# EAGLE schematic XBEErec (EAGLE 6.6.0)
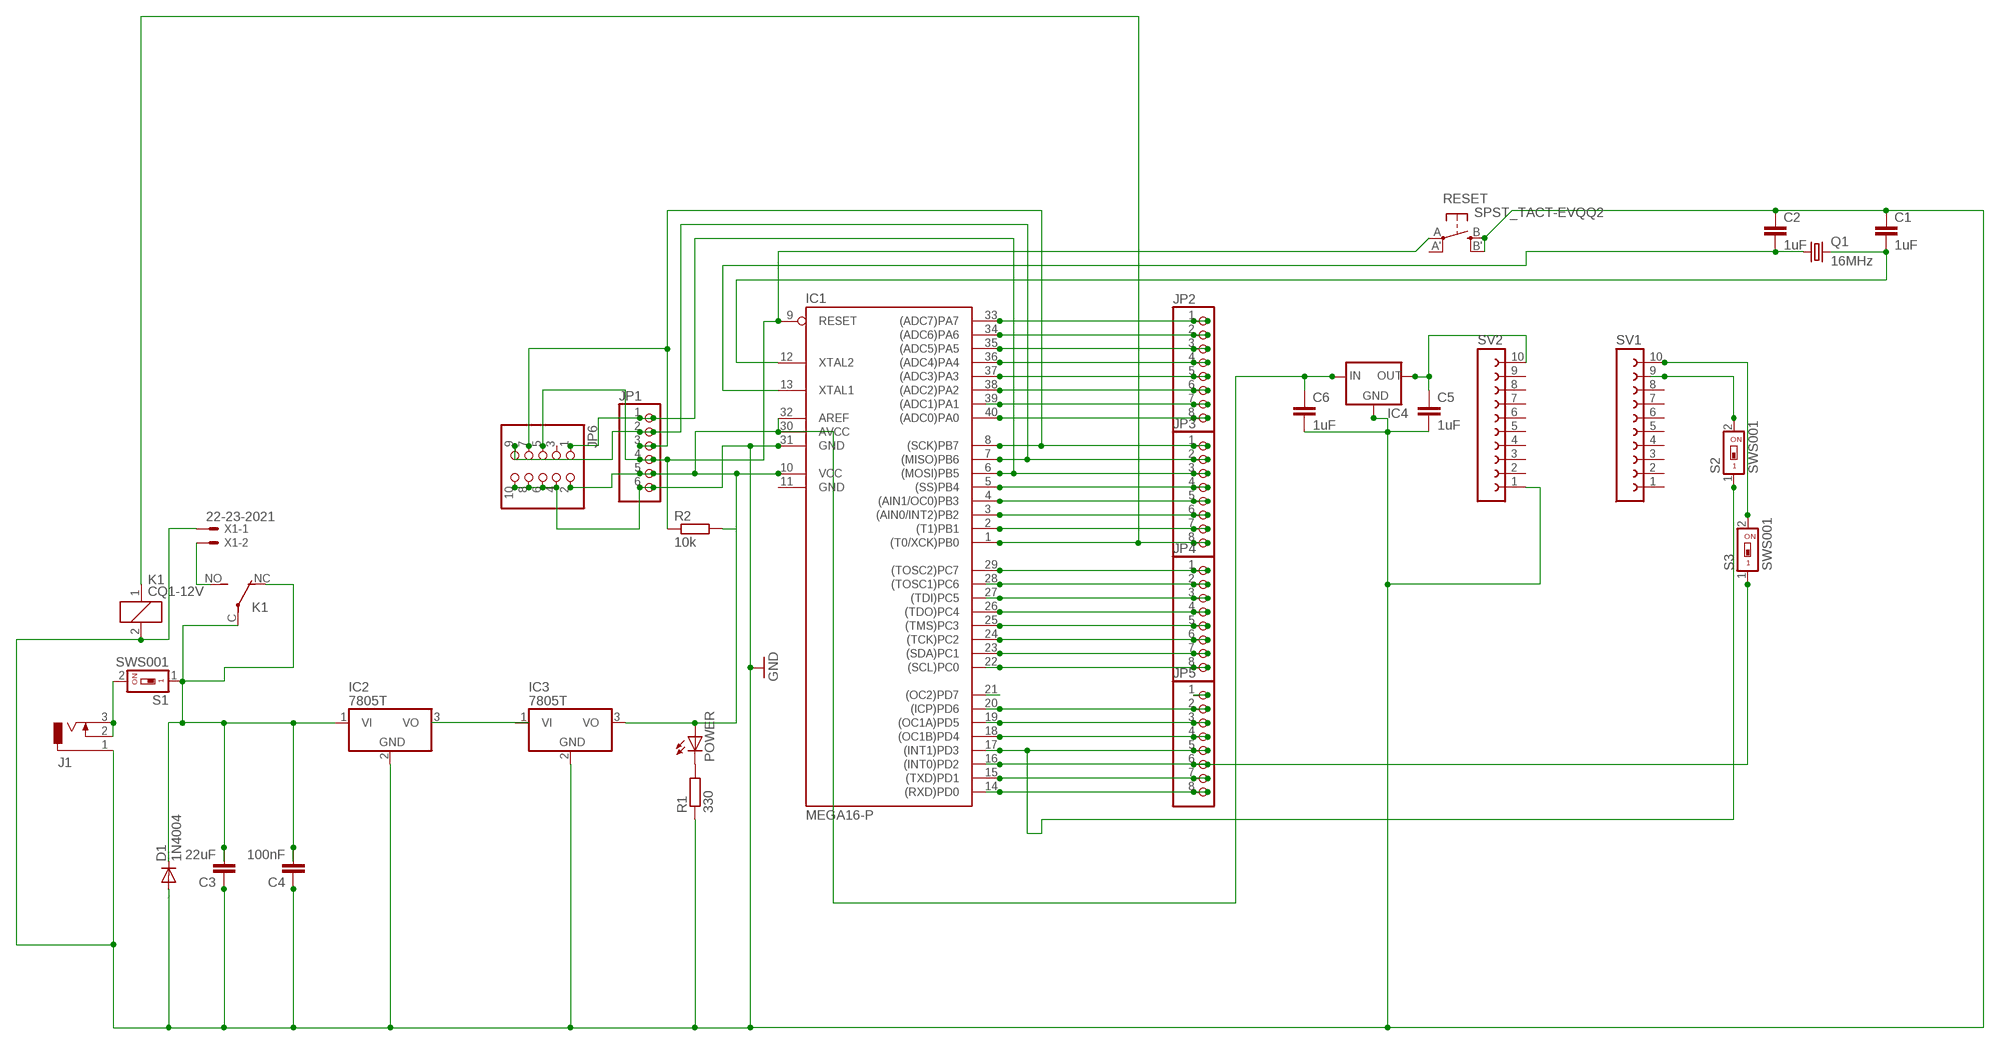
[diagram p0: schematic, sheet 1]

## Parts
C1  1uF  C-EU025-024X044  [C025-024X044]
C2  1uF  C-EU025-024X044  [C025-024X044]
C3  22uF  C-EU025-024X044  [C025-024X044]
C4  100nF  C-EU025-024X044  [C025-024X044]
C5  1uF  C-EU025-025X050  [C025-025X050]
C6  1uF  C-EU025-025X050  [C025-025X050]
D1  1N4004  [DO41-10]
IC1  MEGA16-P  [DIL40]
IC2  7805T  [TO220H]
IC3  7805T  [TO220H]
IC4  MCP1700TRI  [TO92]
J1  DCJ0303  [DCJ0303]
JP1  PINHD-1X6  [1X06]
JP2  PINHD-1X8  [1X08]
JP3  PINHD-1X8  [1X08]
JP4  PINHD-1X8  [1X08]
JP5  PINHD-1X8  [1X08]
JP6  PINHD-2X5  [2X05]
K1  CQ1-12V  [CQ1]
POWER  LED3MM  [LED3MM]
Q1  16MHz  CRYSTALHC49S  [HC49/S]
R1  330  R-EU_0204/5  [0204/5]
R2  10k  R-EU_0204/5  [0204/5]
RESET  SPST_TACT-EVQQ2  [EVQ-Q2]
S1  SWS001  [SMS-001]
S2  SWS001  [SMS-001]
S3  SWS001  [SMS-001]
SV1  FE10-1  [FE10]
SV2  FE10-1  [FE10]
X1  22-23-2021  [22-23-2021]

## Nets
GND: C1.1 C2.1 C3.1 C4.1 C5.2 C6.2 D1.A IC1.31(GND) IC2.2(GND) IC3.2(GND) IC4.1(GND) J1.1 JP1.6 JP6.4 JP6.6 JP6.8 JP6.10 K1.2 R1.1 RESET.B'(S1) RESET.B(S) SV2.1 X1.1
N$2: C6.1 IC1.10(VCC) IC1.30(AVCC) IC1.32(AREF) IC3.3(VO) IC4.2(IN) JP1.5 JP6.2 POWER.A R2.2
N$3: J1.2 J1.3 S1.2
N$4: IC1.33((ADC7)PA7) JP2.1
N$5: IC1.34((ADC6)PA6) JP2.2
N$6: IC1.35((ADC5)PA5) JP2.3
N$7: IC1.36((ADC4)PA4) JP2.4
N$8: IC1.37((ADC3)PA3) JP2.5
N$9: C3.2 C4.2 D1.C IC2.1(VI) K1.C(2:P) K1.NC(2:O) S1.1
N$10: IC1.38((ADC2)PA2) JP2.6
N$11: IC1.39((ADC1)PA1) JP2.7
N$12: IC1.40((ADC0)PA0) JP2.8
N$13: IC1.8((SCK)PB7) JP1.3 JP3.1 JP6.7
N$14: IC1.7((MISO)PB6) JP1.2 JP3.2 JP6.9
N$15: POWER.K(C) R1.2
N$16: IC1.5((SS)PB4) JP3.4
N$17: IC2.3(VO) IC3.1(VI)
N$18: IC1.4((AIN1/OC0)PB3) JP3.5
N$19: IC1.3((AIN0/INT2)PB2) JP3.6
N$20: C5.1 IC4.3(OUT) SV2.10
N$22: IC1.2((T1)PB1) JP3.7
N$23: C2.2 IC1.13(XTAL1) Q1.1
N$24: C1.2 IC1.12(XTAL2) Q1.2
N$25: IC1.1((T0/XCK)PB0) JP3.8 K1.1
N$26: IC1.29((TOSC2)PC7) JP4.1
N$27: S2.2 SV1.9
N$28: IC1.28((TOSC1)PC6) JP4.2
N$29: IC1.27((TDI)PC5) JP4.3
N$30: IC1.26((TDO)PC4) JP4.4
N$31: IC1.25((TMS)PC3) JP4.5
N$32: IC1.24((TCK)PC2) JP4.6
N$33: IC1.23((SDA)PC1) JP4.7
N$34: IC1.22((SCL)PC0) JP4.8
N$35: IC1.21((OC2)PD7)
N$36: IC1.20((ICP)PD6) JP5.2
N$37: IC1.19((OC1A)PD5) JP5.3
N$38: IC1.18((OC1B)PD4) JP5.4
N$39: IC1.17((INT1)PD3) JP5.5 S2.1
N$40: IC1.16((INT0)PD2) JP5.6 S3.1
N$41: IC1.15((TXD)PD1) JP5.7
N$42: S3.2 SV1.10
N$43: IC1.14((RXD)PD0) JP5.8
N$44: IC1.6((MOSI)PB5) JP1.1 JP3.3 JP6.1
N$47: IC1.9(RESET) JP1.4 JP6.5 R2.1 RESET.A(P)
N$50: JP5.1
N$52: K1.NO(2:S) X1.2
Unconnected: JP6.3 RESET.A'(P1) SV1.1 SV1.2 SV1.3 SV1.4 SV1.5 SV1.6 SV1.7 SV1.8 SV2.2 SV2.3 SV2.4 SV2.5 SV2.6 SV2.7 SV2.8 SV2.9

## Power pins joined to a net without a drawn wire
GND: IC1.11(GND)

## Library data of the parts
C1-C6 = rcl:C-EU: CAPACITOR, European symbol
D1 = diode:1N4004: DIODE general purpose rectifier, 1 A
IC1 = atmel:MEGA16-P: MICROCONTROLLER 16 Kbytes FLASH 1 kbytes SRAM 512 bytes EEPROM USART 8-channel 10 bit ADC Source: avr.lbr; MPN: ATMEGA16-16PU; OC_FARNELL: 9171142; OC_NEWARK: 01M6885
IC2 IC3 = adafruit:78*: Positive VOLTAGE REGULATOR Added bigger pads to the TO-92 package
IC4 = adafruit:MCP1700: VOLTAGE REGULATOR
J1 = con-jack:DCJ0303: DC POWER JACK Source: DCJ0303.pdf; OC_FARNELL: unknown; OC_NEWARK: unknown
JP1 = pinhead:PINHD-1X6: PIN HEADER
JP2-JP5 = pinhead:PINHD-1X8: PIN HEADER
JP6 = pinhead:PINHD-2X5: PIN HEADER
K1 = relay:CQ1-12V: AUTOMOTIVE QUIET RELAY NAiS Source: http://www.mew-europe.com/.. en_ds_61208_0000.pdf; OC_FARNELL: unknown; OC_NEWARK: unknown
POWER = adafruit:LED: LED OSRAM: - CHIPLED LG R971, LG N971, LY N971, LG Q971, LY Q971, LO R971, LY R971 LH N974, LH R974 LS Q976, LO Q976, LY Q976 LO Q996 - Hyper CHIPLED LW Q18S LB Q993, LB Q99A, LB R99A - SideLED LS A670, LO A670, LY A670, LG A670, LP A670 LB A673, LV A673, LT A673, LW A673 LH A674 LY A675 LS A676, LA A676, LO A676, LY A676, LW A676 LS A679, LY A679, LG A679 - Hyper Micro SIDELED® LS Y876, LA Y876, LO Y876, LY Y876 LT Y87S - SmartLED LW L88C, LW L88S LB L89C, LB L89S, LG L890 LS L89K, LO L89K, LY L89K LS L896, LA L896, LO L896, LY L896 - TOPLED LS T670, LO T670, LY T670, LG T670, LP T670 LSG T670, LSP T670, LSY T670, LOP T670, LYG T670 LG T671, LOG T671, LSG T671 LB T673, LV T673, LT T673, LW T673 LH T674 LS T676, LA T676, LO T676, LY T676, LB T676, LH T676, LSB T676, LW T676 LB T67C, LV T67C, LT T67C, LS T67K, LO T67K, LY T67K, LW E67C LS E67B, LA E67B, LO E67B, LY E67B, LB E67C, LV E67C, LT E67C LW T67C LS T679, LY T679, LG T679 LS T770, LO T770, LY T770, LG T770, LP T770 LB T773, LV T773, LT T773, LW T773 LH T774 LS E675, LA E675, LY E675, LS T675 LS T776, LA T776, LO T776, LY T776, LB T776 LHGB T686 LT T68C, LB T68C - Hyper Mini TOPLED® LB M676 - Mini TOPLED Santana® LG M470 LS M47K, LO M47K, LY M47K Source: http://www.osram.convergy.de/
Q1 = adafruit:CRYSTAL: CRYSTAL; OC_FARNELL: 1667008; OC_NEWARK: unknown
R1 R2 = rcl:R-EU_: RESISTOR, European symbol
RESET = adafruit:SPST_TACT: SMT 6mm switch, EVQQ2 series http://www.ladyada.net/library/eagle
S1-S3 = smd-special:SWS001: SMD Dip Switch 1 pol.
SV1 SV2 = con-lsta:FE10-1: FEMALE HEADER; OC_FARNELL: unknown; OC_NEWARK: unknown
X1 = con-molex:22-23-2021: .100" (2.54mm) Center Header - 2 Pin; MF: MOLEX; MPN: 22-23-2021; OC_FARNELL: 1462926; OC_NEWARK: 25C3832